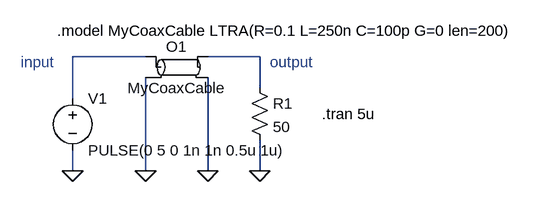
[diagram p0: schematic exp3.asc]
exp3.asc, the LTspice schematic file:
Version 4.1
SHEET 1 880 680
WIRE 192 48 80 48
WIRE 368 48 288 48
WIRE 368 96 368 48
WIRE 80 112 80 48
WIRE 80 224 80 192
WIRE 192 224 192 80
WIRE 288 224 288 80
WIRE 368 224 368 176
FLAG 80 224 0
FLAG 192 224 0
FLAG 288 224 0
FLAG 368 224 0
SYMBOL voltage 80 96 R0
WINDOW 123 0 0 Left 0
WINDOW 39 0 0 Left 0
SYMATTR InstName V1
SYMATTR Value PULSE(0 5 0 1n 1n 0.5u 1u)
SYMBOL ltline 240 64 R0
SYMATTR InstName O1
SYMATTR Value MyCoaxCable
SYMBOL res 352 80 R0
SYMATTR InstName R1
SYMATTR Value 50
TEXT 56 8 Left 2 !.model MyCoaxCable LTRA(R=0.1 L=250n C=100p G=0 len=200)
TEXT 464 136 Left 2 !.tran 5u
TEXT 0 56 Left 2 ;input
TEXT 384 56 Left 2 ;output

The netlist it stands for:
* exp3.asc
V1 N001 0 PULSE(0 5 0 1n 1n 0.5u 1u)
O1 N001 0 N002 0 MyCoaxCable
R1 N002 0 50
.model MyCoaxCable LTRA(R=0.1 L=250n C=100p G=0 len=200)
.tran 5u
* input
* output
.backanno
.end